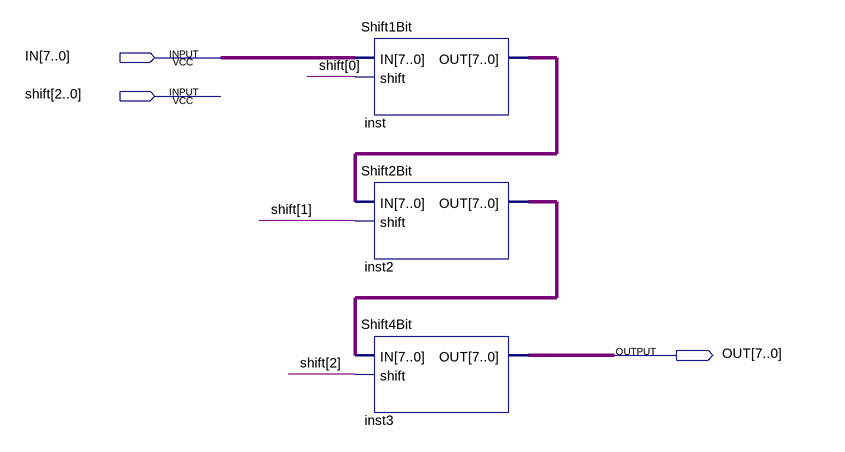
[diagram p0: schematic sheet]
// Quartus schematic BarrelShifter8Bit.bdf as structural Verilog: 3 symbols, 3 pins
module BarrelShifter8Bit (
  input  [7:0] IN,
  input  [2:0] shift,
  output [7:0] OUT
);

  wire [7:0] inst2_out, inst_out;

  Shift1Bit inst (.IN(IN), .shift(shift[0]), .OUT(inst_out));
  Shift2Bit inst2 (.IN(inst_out), .shift(shift[1]), .OUT(inst2_out));
  Shift4Bit inst3 (.IN(inst2_out), .shift(shift[2]), .OUT(OUT));
endmodule
